# Altium schematic sheet DSO_Front.SchDoc: Schematic_Name
size A4; CompanyName: University of Melbourne; Engineer: Your Name Here; DocumentNumber: 1; Revision: 0.1; SheetNumber: 1; SheetTotal: 1; Title_Project: Project_Title; StudentNo: Student No.
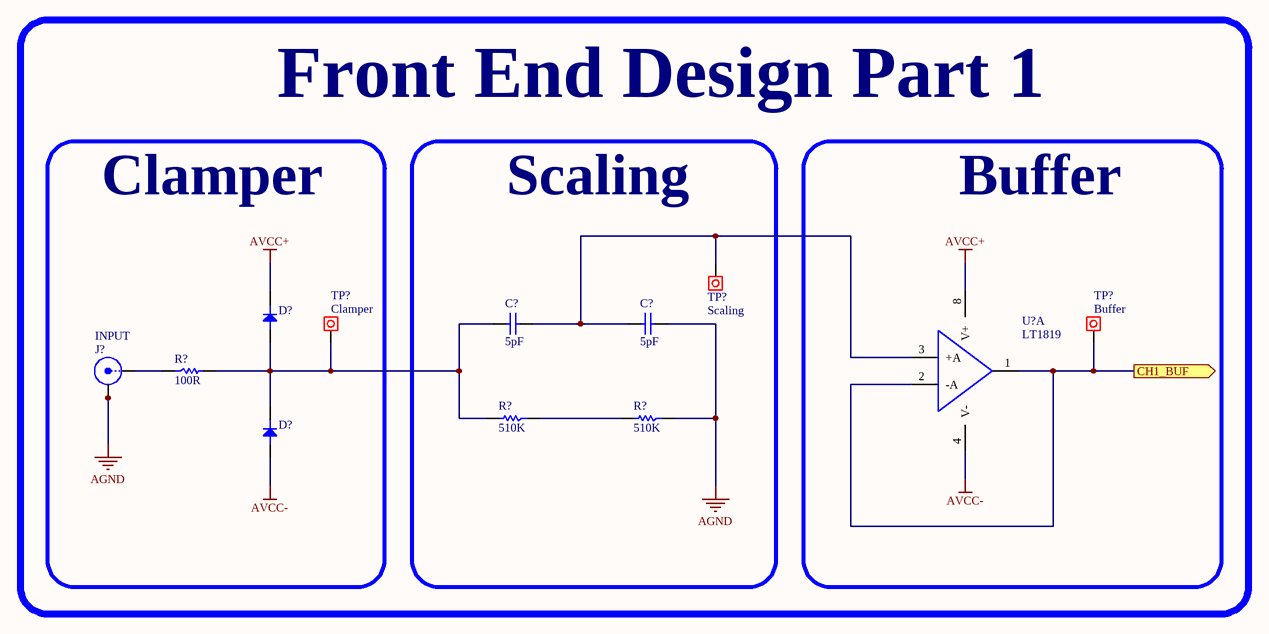
[diagram p0: DSO_Front.SchDoc]

## Parts
(Parts that share a designator on the sheet are numbered #1, #2 ... from top to bottom, then left to right.)
C?#1  5pF  [0805C]
C?#2  5pF  [0805C]
D?#1  Diode  [SOD-123]  (value not drawn)
D?#2  Diode  [SOD-123]  (value not drawn)
J?  INPUT  [BNC_VERT]
R?#1  100R  [0805]
R?#2  510K  [0805]
R?#3  510K  [0805]
TP?#1  value Scaling  [Testpoin]  (hidden comment: INPUT)
TP?#2  value Clamper  [Testpoin]  (hidden comment: INPUT)
TP?#3  value Buffer  [Testpoin]  (hidden comment: INPUT)
U?  LT1819  [SOIC-8]  (part A of 2)

## Blocks framed on the sheet
Clamper: D?#1 D?#2 J? R?#1 TP?#2
Scaling: C?#1 C?#2 R?#2 R?#3 TP?#1
Buffer: TP?#3 U?

## Ports
CH1_BUF (out)

## Nets
AGND: C?#2.1 J?.2(Y) J?.3(Y) J?.4(Y) J?.5(Y) R?#3.1
AVCC+: D?#1.K U?.8(V+)
AVCC-: D?#2.A U?.4(V-)
CH1_BUF: TP?#3.1 U?.1(OUTA) U?.2(-A) ; port CH1_BUF
NetC?#1_1: C?#1.1 C?#2.2 TP?#1.1 U?.3(+A)
NetC?#1_2: C?#1.2 D?#1.A D?#2.K R?#1.2 R?#2.2 TP?#2.1
NetJ?_1: J?.1(X) R?#1.1
NetR?#2_1: R?#2.1 R?#3.2

## Notes on the sheet
- Front End Design Part 1

## Library data of the parts
C?#1 C?#2 = C: Capacitor; Reviewed by: RM - 2018/08/05; Revision: July-2002: Re-released for DXP Platform.; Supplier 1: *; Supplier Part Number 1: *; Value: 5pF
D?#1 D?#2 = D: Reviewed by: RM - 2018/08/05; Revision: July-2002: Re-released for DXP Platform.; Supplier 1: *; Supplier Part Number 1: *
J? = BNC: BNC Straight; Reviewed by: RM - 2018/08/05; Supplier Part Number 1: A97581-ND; Supplier 1: Digi-Key
R?#1-R?#3 = R: Resistor; Reviewed by: RM - 2018/08/05; Supplier 1: *; Suppler Part Number 1: *
  R?#1: Value: 100R
  R?#2 R?#3: Value: 510K
TP?#1-TP?#3 = Test Point: Pad
U? = LT1819: OpAmp High Frequency Dual; Reviewed by: RM - 2018/08/05; Supplier 1: Digi-Key; Supplier Part Number 1: LT1819CMS8#PBF-ND